# Altium project ice40.PrjPcb
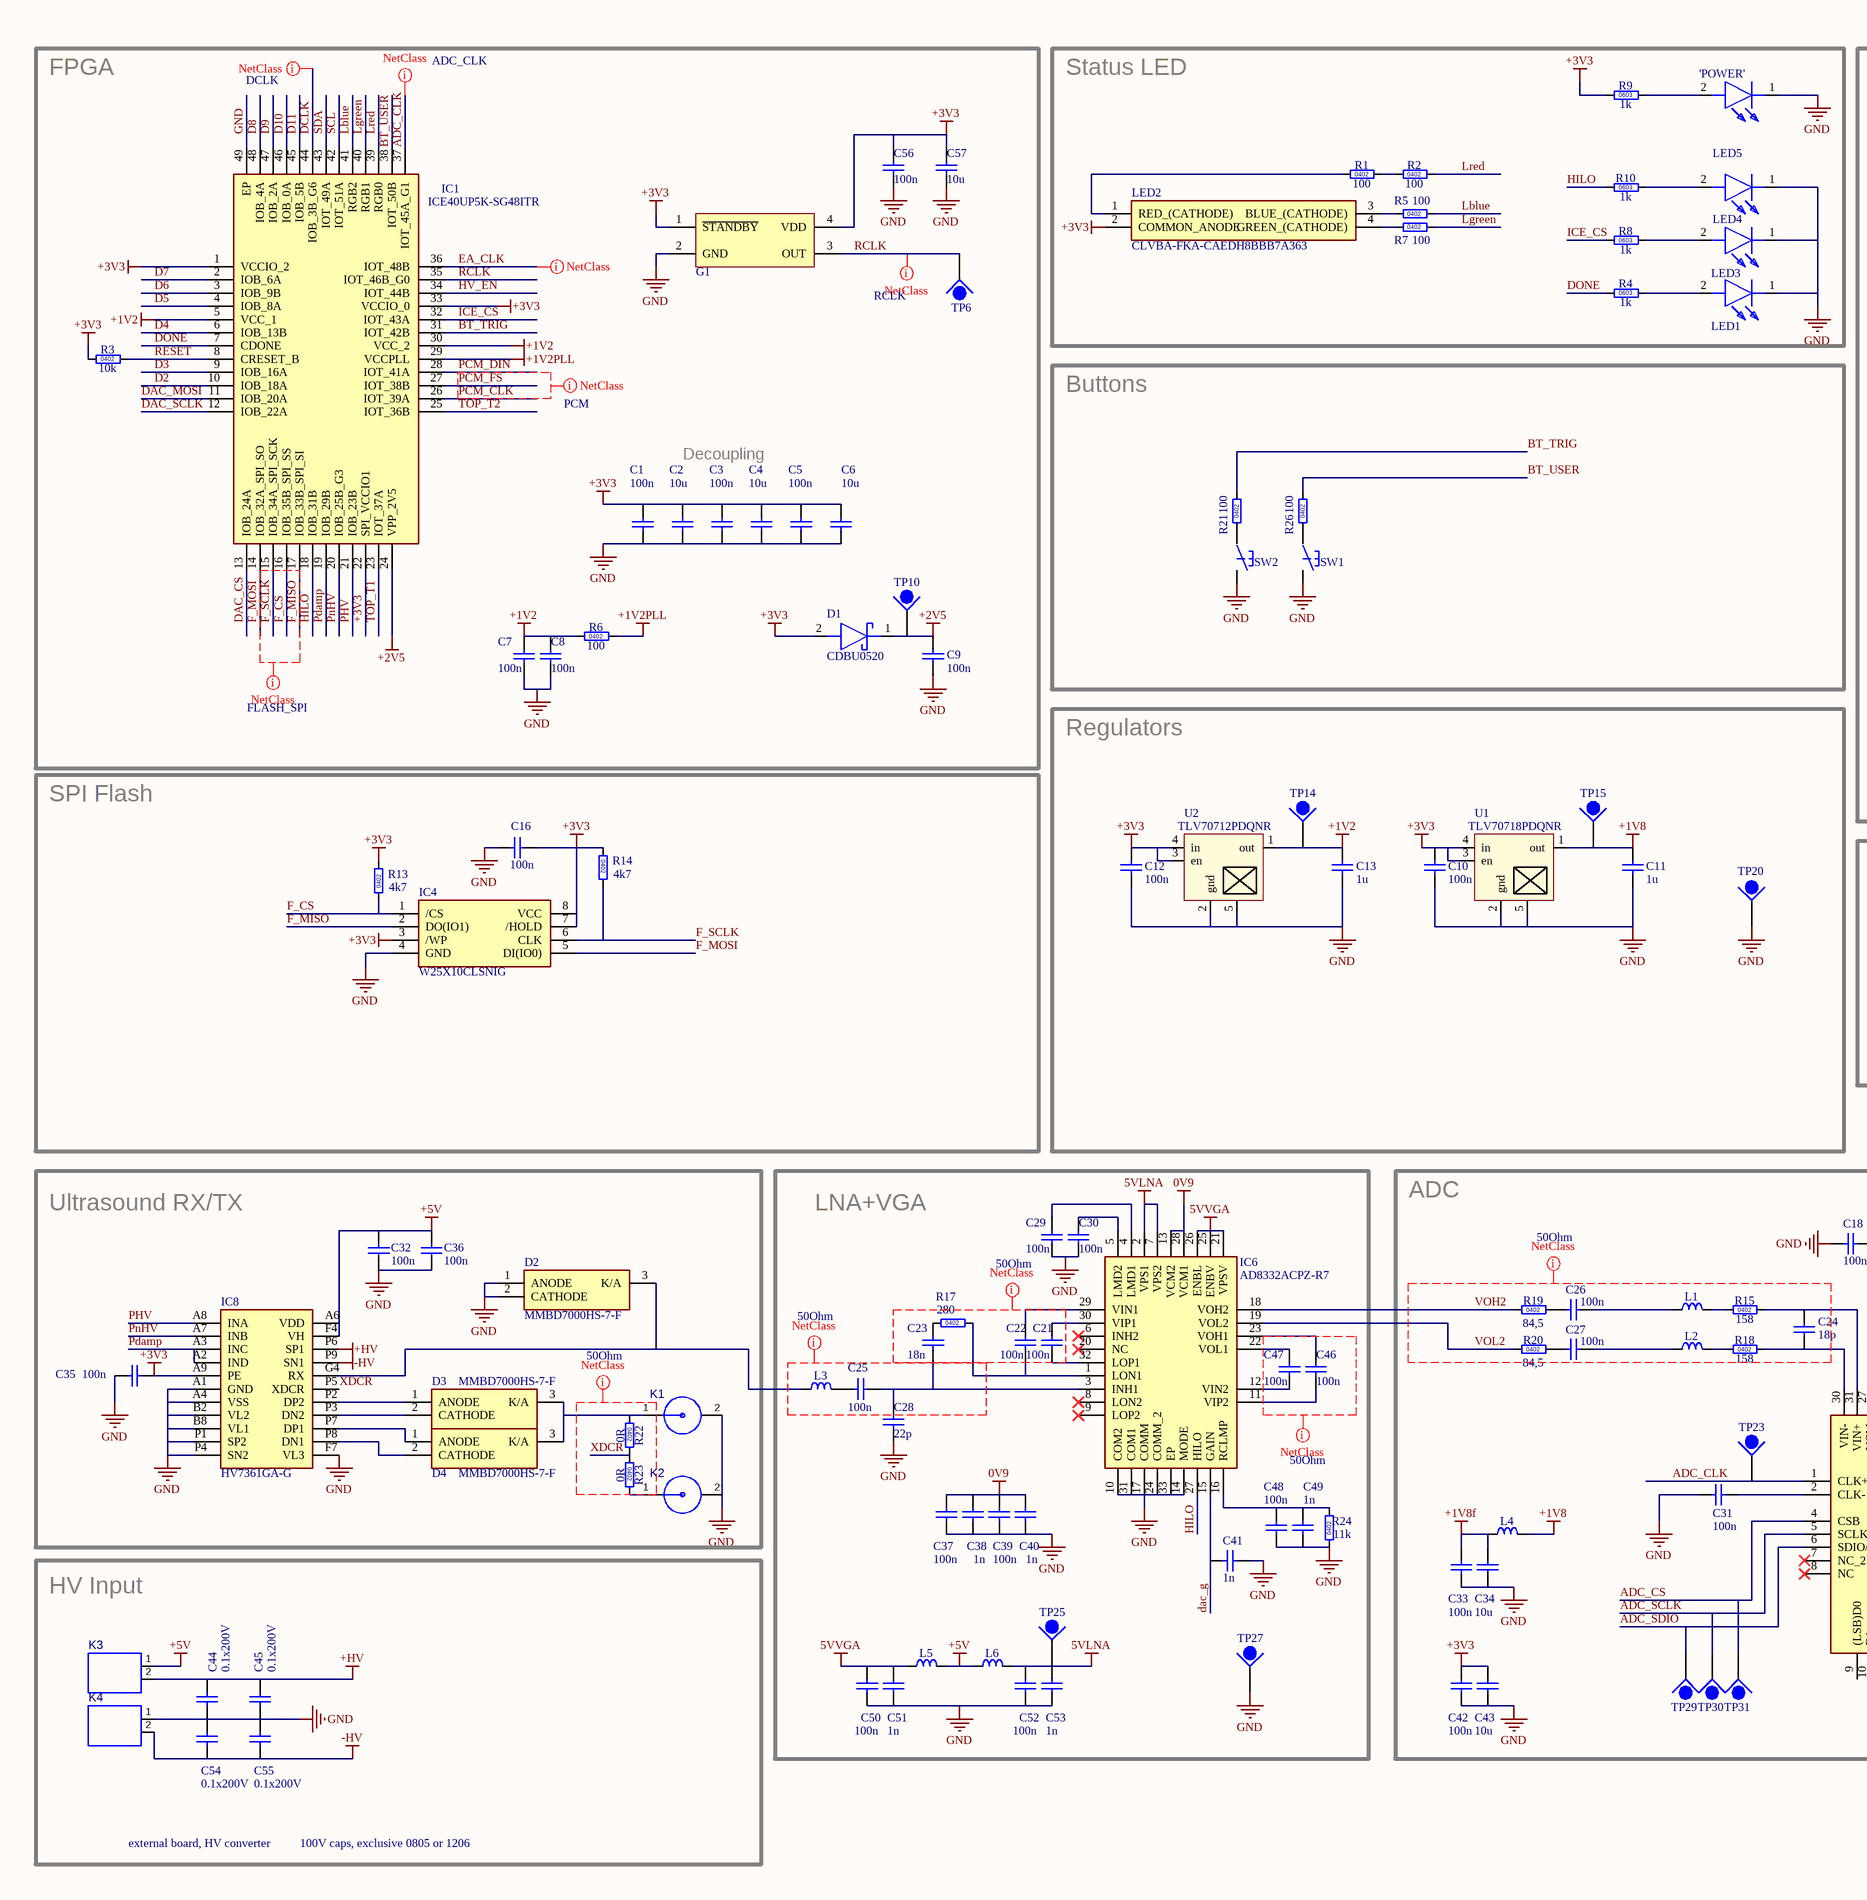
[diagram p0: ice40.SchDoc, left]
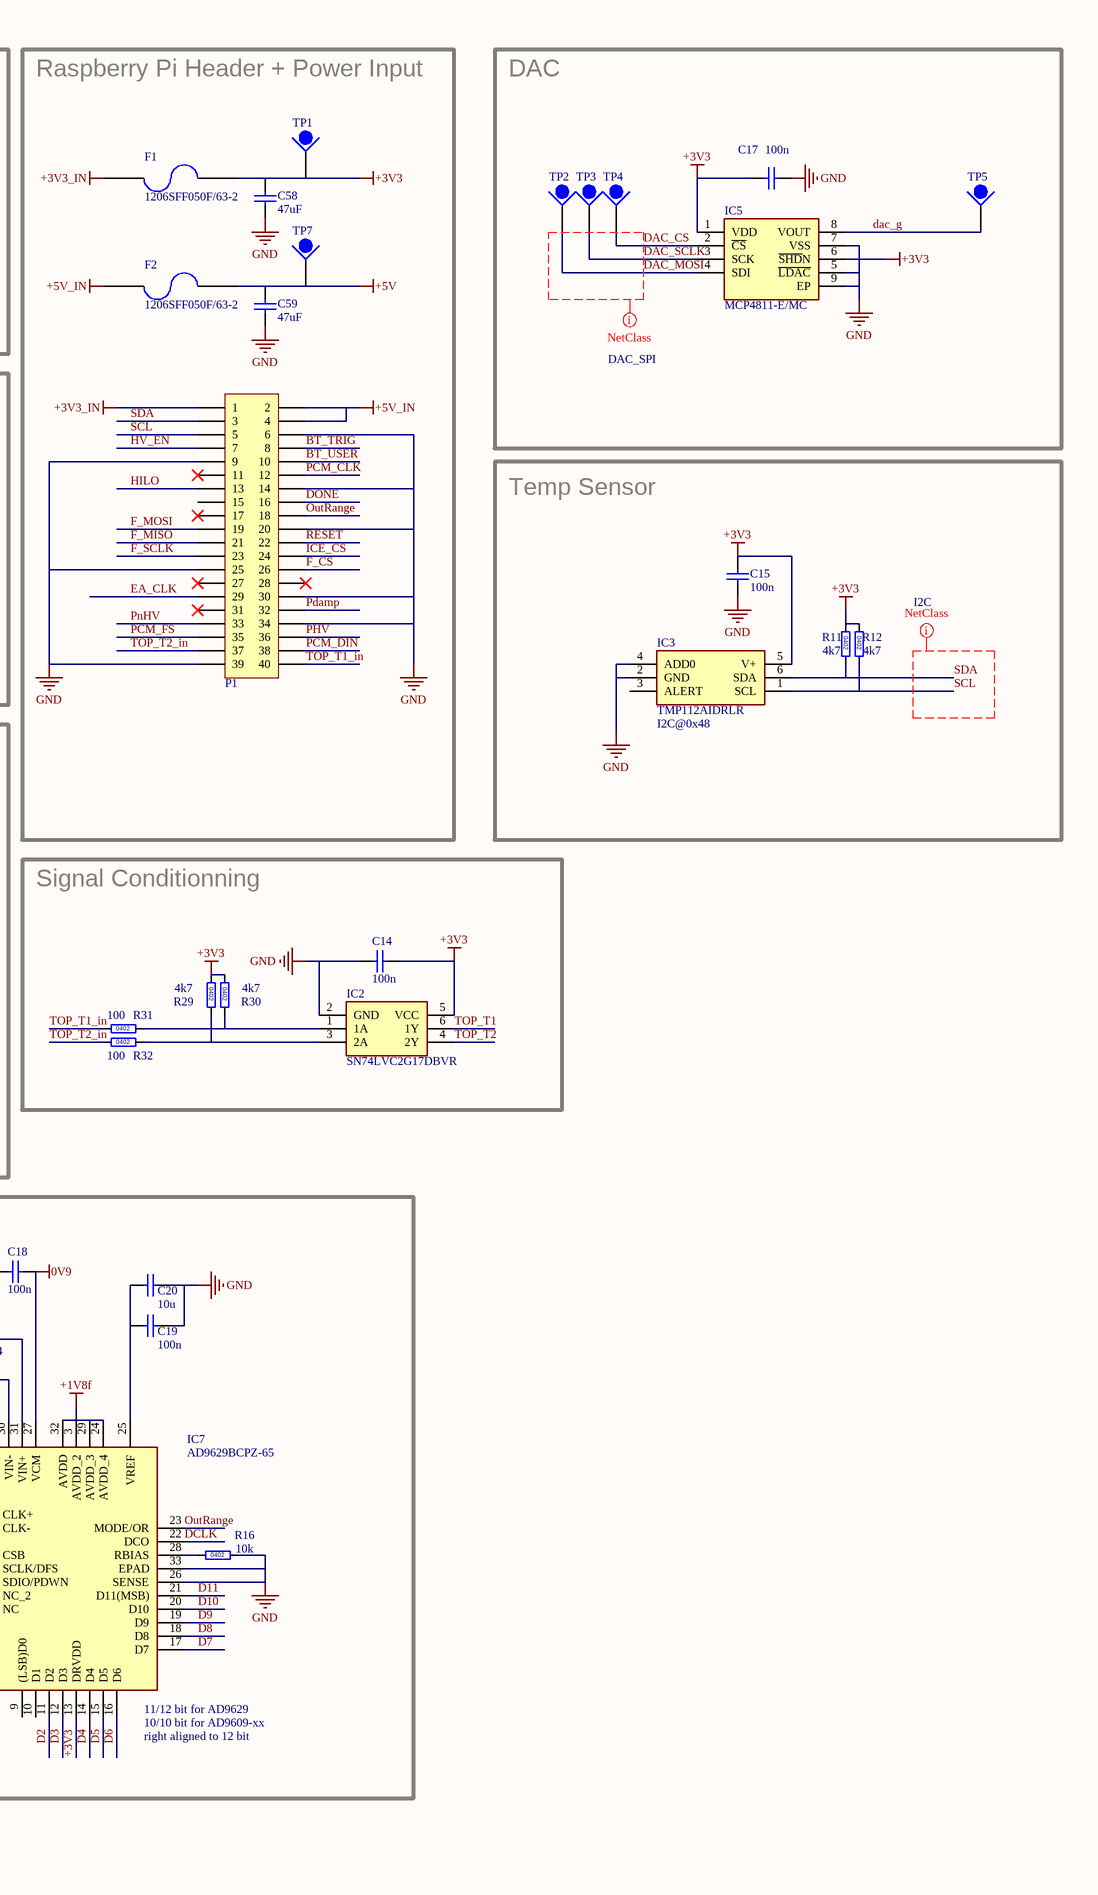
[diagram p1: ice40.SchDoc, right]
1 sheet, 140 parts. Net scope: global (net labels, ports and power ports of the same name join across sheets).
Board file: ice.PcbDoc

## Sheet ice40.SchDoc
size A2; Organization: Altium Limited; Address1: 75 Boul de Mortagne; Address2: Boucherville; Address3: J4B 6Y4; Address4: Canada; ResearchCenter: EME

### Parts
C1  value 100n  [SM0402_3D_cap]  (hidden comment: cap0402)
C2  value 10u  [SM0402_3D_cap]  (hidden comment: cap0402)
C3  value 100n  [SM0402_3D_cap]  (hidden comment: cap0402)
C4  value 10u  [SM0402_3D_cap]  (hidden comment: cap0402)
C5  value 100n  [SM0402_3D_cap]  (hidden comment: cap0402)
C6  value 10u  [SM0402_3D_cap]  (hidden comment: cap0402)
C7  value 100n  [SM0402_3D_cap]  (hidden comment: cap0402)
C8  value 100n  [SM0402_3D_cap]  (hidden comment: cap0402)
C9  value 100n  [SM0402_3D_cap]  (hidden comment: cap0402)
C10  value 100n  [SM0402_3D_cap]  (hidden comment: cap0402)
C11  value 1u  [SM0402_3D_cap]  (hidden comment: cap0402)
C12  value 100n  [SM0402_3D_cap]  (hidden comment: cap0402)
C13  value 1u  [SM0402_3D_cap]  (hidden comment: cap0402)
C14  value 100n  [SM0402_3D_cap]  (hidden comment: cap0402)
C15  value 100n  [SM0402_3D_cap]  (hidden comment: cap0402)
C16  value 100n  [SM0402_3D_cap]  (hidden comment: cap0402)
C17  value 100n  [SM0402_3D_cap]  (hidden comment: cap0402)
C18  value 100n  [SM0402_3D_cap]  (hidden comment: cap0402)
C19  value 100n  [SM0402_3D_cap]  (hidden comment: cap0402)
C20  value 10u  [SM0402_3D_cap]  (hidden comment: cap0402)
C21  value 100n  [SM0402_3D_cap]  (hidden comment: cap0402)
C22  value 100n  [SM0402_3D_cap]  (hidden comment: cap0402)
C23  value 18n  [SM0402_3D_cap]  (hidden comment: cap0402)
C24  value 18p  [SM0402_3D_cap]  (hidden comment: cap0402)
C25  value 100n  [SM0402_3D_cap]  (hidden comment: cap0402)
C26  value 100n  [SM0402_3D_cap]  (hidden comment: cap0402)
C27  value 100n  [SM0402_3D_cap]  (hidden comment: cap0402)
C28  value 22p  [SM0402_3D_cap]  (hidden comment: cap0402)
C29  value 100n  [SM0402_3D_cap]  (hidden comment: cap0402)
C30  value 100n  [SM0402_3D_cap]  (hidden comment: cap0402)
C31  value 100n  [SM0402_3D_cap]  (hidden comment: cap0402)
C32  value 100n  [SM0402_3D_cap]  (hidden comment: cap0402)
C33  value 100n  [SM0402_3D_cap]  (hidden comment: cap0402)
C34  value 10u  [SM0402_3D_cap]  (hidden comment: cap0402)
C35  value 100n  [SM0402_3D_cap]  (hidden comment: cap0402)
C36  value 100n  [SM0402_3D_cap]  (hidden comment: cap0402)
C37  value 100n  [SM0402_3D_cap]  (hidden comment: cap0402)
C38  value 1n  [SM0402_3D_cap]  (hidden comment: cap0402)
C39  value 100n  [SM0402_3D_cap]  (hidden comment: cap0402)
C40  value 1n  [SM0402_3D_cap]  (hidden comment: cap0402)
C41  value 1n  [SM0402_3D_cap]  (hidden comment: cap0402)
C42  value 100n  [SM0402_3D_cap]  (hidden comment: cap0402)
C43  value 10u  [SM0402_3D_cap]  (hidden comment: cap0402)
C44  value 0.1x200V  [SM0805]  (hidden comment: cap0805)
C45  value 0.1x200V  [SM1206]  (hidden comment: cap1206)
C46  value 100n  [SM0402_3D_cap]  (hidden comment: cap0402)
C47  value 100n  [SM0402_3D_cap]  (hidden comment: cap0402)
C48  value 100n  [SM0402_3D_cap]  (hidden comment: cap0402)
C49  value 1n  [SM0402_3D_cap]  (hidden comment: cap0402)
C50  value 100n  [SM0402_3D_cap]  (hidden comment: cap0402)
C51  value 1n  [SM0402_3D_cap]  (hidden comment: cap0402)
C52  value 100n  [SM0402_3D_cap]  (hidden comment: cap0402)
C53  value 1n  [SM0402_3D_cap]  (hidden comment: cap0402)
C54  value 0.1x200V  [SM0805]  (hidden comment: cap0805)
C55  value 0.1x200V  [SM1206]  (hidden comment: cap1206)
C56  value 100n  [SM0402_3D_cap]  (hidden comment: cap0402)
C57  value 10u  [SM0402_3D_cap]  (hidden comment: cap0402)
C58  value 47uF  [CAP_CERAMIC_1206]  (hidden comment: Capacitor)
C59  value 47uF  [CAP_CERAMIC_1206]  (hidden comment: Capacitor)
D1  CDBU0520  [DIOC1709X85N]
D2  MMBD7000HS-7-F  [SOT96P240X110-3N]
D3  MMBD7000HS-7-F  [SOT96P240X110-3N]
D4  MMBD7000HS-7-F  [SOT96P240X110-3N]
F1  1206SFF050F/63-2  [FUSE_1206]
F2  1206SFF050F/63-2  [FUSE_1206]
G1  Oscillator  [OSC_ASEM]  (value not drawn)
IC1  ICE40UP5K-SG48ITR  [QFN50P700X700X100-49N-D]
IC2  SN74LVC2G17DBVR  [SOT95P280X145-6N]
IC3  TMP112AIDRLR  [SOTFL50P160X60-6N]
IC4  W25X10CLSNIG  [SOIC127P600X175-8N]
IC5  MCP4811-E/MC  [SON50P200X300X100-9N]
IC6  AD8332ACPZ-R7  [QFN50P500X500X100-33N]
IC7  AD9629BCPZ-65  [QFN50P500X500X100-33N]
IC8  HV7361GA-G  [BGA22C50P9X14_500X700X105]
K1  SMA_Edge  [AMPHENOL_132357-11]  (value not drawn)
K2  SMA_Edge  [AMPHENOL_132357-11]  (value not drawn)
K3  1x2PLS  [JUMPER2]  (value not drawn)
K4  1x2PLS  [JUMPER2]  (value not drawn)
L1  75R@100MHz  [SM_0805_INDUCTANCE _3D]  (value not drawn)
L2  75R@100MHz  [SM_0805_INDUCTANCE _3D]  (value not drawn)
L3  75R@100MHz  [SM_0805_INDUCTANCE _3D]  (value not drawn)
L4  75R@100MHz  [SM_0805_INDUCTANCE _3D]  (value not drawn)
L5  75R@100MHz  [SM_0805_INDUCTANCE _3D]  (value not drawn)
L6  75R@100MHz  [SM_0805_INDUCTANCE _3D]  (value not drawn)
LED1  HSMW-C191  [LEDC1608X70N]  (value not drawn)
LED2  CLVBA-FKA-CAEDH8BBB7A363  [CLVBAFKACAEDH8BBB7A363]
LED3  HSMW-C191  [LEDC1608X70N]  (value not drawn)
LED4  HSMW-C191  [LEDC1608X70N]  (value not drawn)
LED5  HSMW-C191  [LEDC1608X70N]  (value not drawn)
P1  2x20 2.54mm vertical  [PLD-40]  (value not drawn)
R1  100  [SM0402_3D_res]
R2  100  [SM0402_3D_res]
R3  10k  [SM0402_3D_res]
R4  1k  [SM0603_3D_res]
R5  100  [SM0402_3D_res]
R6  100  [SM0402_3D_res]
R7  100  [SM0402_3D_res]
R8  1k  [SM0603_3D_res]
R9  1k  [SM0603_3D_res]
R10  1k  [SM0603_3D_res]
R11  4k7  [SM0402_3D_res]
R12  4k7  [SM0402_3D_res]
R13  4k7  [SM0402_3D_res]
R14  4k7  [SM0402_3D_res]
R15  158  [SM0402_3D_res]
R16  10k  [SM0402_3D_res]
R17  280  [SM0402_3D_res]
R18  158  [SM0402_3D_res]
R19  84,5  [SM0402_3D_res]
R20  84,5  [SM0402_3D_res]
R21  100  [SM0402_3D_res]
R22  0R  [SM0402_3D_res]
R23  0R  [SM0402_3D_res]
R24  11k  [SM0402_3D_res]
R26  100  [SM0402_3D_res]
R29  4k7  [SM0402_3D_res]
R30  4k7  [SM0402_3D_res]
R31  100  [SM0402_3D_res]
R32  100  [SM0402_3D_res]
SW1  EVQ-P9P02M  [Button 4.7x3.5 _SMT]  (value not drawn)
SW2  EVQ-P9P02M  [Button 4.7x3.5 _SMT]  (value not drawn)
TP1  TP80  [TP80_no_silk]  (value not drawn)  (no BOM)
TP2  TP80  [TP80_no_silk]  (value not drawn)  (no BOM)
TP3  TP80  [TP80_no_silk]  (value not drawn)  (no BOM)
TP4  TP80  [TP80_no_silk]  (value not drawn)  (no BOM)
TP5  TP80  [TP80_no_silk]  (value not drawn)  (no BOM)
TP6  TP80  [TP80_no_silk]  (value not drawn)  (no BOM)
TP7  TP80  [TP80_no_silk]  (value not drawn)  (no BOM)
TP10  TP80  [TP80_no_silk]  (value not drawn)  (no BOM)
TP14  TP80  [TP80_no_silk]  (value not drawn)  (no BOM)
TP15  TP80  [TP80_no_silk]  (value not drawn)  (no BOM)
TP20  TP125X75  [TP125X75]  (value not drawn)  (no BOM)
TP23  TP80  [TP80_no_silk]  (value not drawn)  (no BOM)
TP25  TP80  [TP80_no_silk]  (value not drawn)  (no BOM)
TP27  TP80  [TP80_no_silk]  (value not drawn)  (no BOM)
TP29  TP80  [TP80_no_silk]  (value not drawn)  (no BOM)
TP30  TP80  [TP80_no_silk]  (value not drawn)  (no BOM)
TP31  TP80  [TP80_no_silk]  (value not drawn)  (no BOM)
U1  TLV70718PDQNR  [X2SON - 2]
U2  TLV70712PDQNR  [X2SON - 2]

### Blocks framed on the sheet
FPGA: C1-C9 C56 C57 D1 G1 IC1 R3 R6 TP6 TP10
Status LED: LED1-LED5 R1 R2 R4 R5 R7-R10
Raspberry Pi Header + Power Input: C58 C59 F1 F2 P1 TP1 TP7
DAC: C17 IC5 TP2-TP5
Buttons: R21 R26 SW1 SW2
Temp Sensor: C15 IC3 R11 R12
Regulators: C10-C13 TP14 TP15 TP20 U1 U2
SPI Flash: C16 IC4 R13 R14
Signal Conditionning: C14 IC2 R29-R32
Ultrasound RX/TX: C32 C35 C36 D2-D4 IC8 K1 K2 R22 R23
LNA+VGA: C21-C23 C25 C28-C30 C37-C41 C46-C53 IC6 L3 L5 L6 R17 R24 TP25 TP27
ADC: C18-C20 C24 C26 C27 C31 C33 C34 C42 C43 IC7 L1 L2 L4 R15 R16 R18-R20 TP23 TP29-TP31
HV Input: C44 C45 C54 C55 K3 K4

### Nets
0V9: C18.1 C37.2 C38.2 C39.2 C40.2 IC6.13(VCM2) IC6.28(VCM1) IC7.27(VCM)
5VLNA: C52.2 C53.2 IC6.2(VPS1) IC6.7(VPS2) L6.2 TP25.1
5VVGA: C50.2 C51.2 IC6.21(VPSV) IC6.25(ENBV) IC6.26(ENBL) L5.1
+1V2: C7.2 C8.2 C13.2 IC1.5(VCC_1) IC1.30(VCC_2) R6.1 TP14.1 U2.1(out)
+1V2PLL: IC1.29(VCCPLL) R6.2
+1V8: C11.2 L4.2 TP15.1 U1.1(out)
+1V8f: C33.2 C34.2 IC7.3(AVDD_2) IC7.24(AVDD_4) IC7.29(AVDD_3) IC7.32(AVDD) L4.1
+2V5: C9.2 D1.1(K) IC1.24(VPP_2V5) TP10.1
+3V3: C1.2 C2.2 C3.2 C4.2 C5.2 C6.2 C10.2 C12.2 C14.2 C15.1 C16.1 C17.2 C35.1 C42.2 C43.2 C56.2 C57.2 C58.2 D1.2(A) F1.2 G1.1(~{STANDBY}) G1.4(VDD) IC1.1(VCCIO_2) IC1.22(SPI_VCCIO1) IC1.33(VCCIO_0) IC2.5(VCC) IC3.5(V+) IC4.3(/WP) IC4.7(/HOLD) IC4.8(VCC) IC5.1(VDD) IC5.6(~{SHD}N) IC7.13(DRVDD) IC8.A9(PE) LED2.2(COMMON_ANODE) R3.1 R9.1 R11.1 R12.1 R13.2 R14.1 R29.1 R30.1 TP1.1 U1.3(en) U1.4(in) U2.3(en) U2.4(in)
+3V3_IN: F1.1 P1.1
+5V: C32.1 C36.2 C59.2 F2.2 IC8.A6(VDD) IC8.F4(VH) K3.1 L5.2 L6.1 TP7.1
+5V_IN: F2.1 P1.2 P1.4
+HV: C44.2 C45.2 IC8.P6(SP1) K3.2
-HV: C54.1 C55.1 IC8.P9(SN1) K4.2
GND: C1.1 C2.1 C3.1 C4.1 C5.1 C6.1 C7.1 C8.1 C9.1 C10.1 C11.1 C12.1 C13.1 C14.1 C15.2 C16.2 C17.1 C18.2 C19.1 C20.1 C28.2 C29.2 C30.2 C31.2 C32.2 C33.1 C34.1 C35.2 C36.1 C37.1 C38.1 C39.1 C40.1 C41.1 C42.1 C43.1 C44.1 C45.1 C48.1 C49.1 C50.1 C51.1 C52.1 C53.1 C54.2 C55.2 C56.1 C57.1 C58.1 C59.1 D2.1(ANODE) D2.2(CATHODE) G1.2(GND) IC1.49(EP) IC2.2(GND) IC3.2(GND) IC3.4(ADD0) IC4.4(GND) IC5.5(~{LDAC}) IC5.7(VSS) IC5.9(EP) IC6.10(COM2) IC6.14(MODE) IC6.17(COMM) IC6.24(COMM_2) IC6.31(COM1) IC6.33(EP) IC7.26(SENSE) IC7.33(EPAD) IC8.A1(GND) IC8.A4(VSS) IC8.B2(VL2) IC8.B8(VL1) IC8.F7(VL3) IC8.P1(SP2) IC8.P4(SN2) K1.2 K2.2 K4.1 LED1.1(K) LED3.1(K) LED4.1(K) LED5.1(K) P1.6 P1.9 P1.14 P1.20 P1.25 P1.30 P1.34 P1.39 R16.2 R24.1 SW1.3 SW1.4 SW2.3 SW2.4 TP20.1 TP27.1 U1.2(gnd) U1.5(tp) U2.2(gnd) U2.5(tp)
ADC_CLK: IC1.37(IOT_45A_G1) IC7.1(CLK+) TP23.1
ADC_CS: IC7.4(CSB) TP31.1
ADC_SCLK: IC7.5(SCLK/DFS) TP30.1
ADC_SDIO: IC7.6(SDIO/PDWN) TP29.1
BT_TRIG: IC1.31(IOT_42B) P1.8 R21.2
BT_USER: IC1.38(IOT_50B) P1.10 R26.2
D2: IC1.10(IOB_18A) IC7.11(D2)
D3: IC1.9(IOB_16A) IC7.12(D3)
D4: IC1.6(IOB_13B) IC7.14(D4)
D5: IC1.4(IOB_8A) IC7.15(D5)
D6: IC1.3(IOB_9B) IC7.16(D6)
D7: IC1.2(IOB_6A) IC7.17(D7)
D8: IC1.48(IOB_4A) IC7.18(D8)
D9: IC1.47(IOB_2A) IC7.19(D9)
D10: IC1.46(IOB_0A) IC7.20(D10)
D11: IC1.45(IOB_5B) IC7.21(D11(MSB))
DAC_CS: IC1.13(IOB_24A) IC5.2(~{CS}) TP4.1
dac_g: C41.2 IC5.8(VOUT) IC6.15(GAIN) TP5.1
DAC_MOSI: IC1.11(IOB_20A) IC5.4(SDI) TP2.1
DAC_SCLK: IC1.12(IOB_22A) IC5.3(SCK) TP3.1
DCLK: IC1.44(IOB_3B_G6) IC7.22(DCO)
DONE: IC1.7(CDONE) P1.16 R4.1
EA_CLK: IC1.36(IOT_48B) P1.29
F_CS: IC1.16(IOB_35B_SPI_SS) IC4.1(/CS) P1.26 R13.1
F_MISO: IC1.17(IOB_33B_SPI_SI) IC4.2(DO(IO1)) P1.21
F_MOSI: IC1.14(IOB_32A_SPI_SO) IC4.5(DI(IO0)) P1.19
F_SCLK: IC1.15(IOB_34A_SPI_SCK) IC4.6(CLK) P1.23 R14.2
HILO: IC1.18(IOB_31B) IC6.27(HILO) P1.13 R10.1
HV_EN: IC1.34(IOT_44B) P1.7
ICE_CS: IC1.32(IOT_43A) P1.24 R8.1
Lblue: IC1.41(RGB2) R5.2
Lgreen: IC1.40(RGB1) R7.2
Lred: IC1.39(RGB0) R2.2
OutRange: IC7.23(MODE/OR) P1.18
PCM_CLK: IC1.26(IOT_39A) P1.12
PCM_DIN: IC1.28(IOT_41A) P1.38
PCM_FS: IC1.27(IOT_38B) P1.35
Pdamp: IC1.19(IOB_29B) IC8.A2(IND) IC8.A3(INC) P1.32
PHV: IC1.21(IOB_23B) IC8.A8(INA) P1.36
PnHV: IC1.20(IOB_25B_G3) IC8.A7(INB) P1.33
RCLK: G1.3(OUT) IC1.35(IOT_46B_G0) TP6.1
RESET: IC1.8(CRESET_B) P1.22 R3.2
SCL: IC1.42(IOT_51A) IC3.1(SCL) P1.5 R12.2
SDA: IC1.43(IOT_49A) IC3.6(SDA) P1.3 R11.2
TOP_T1: IC1.23(IOT_37A) IC2.6(1Y)
TOP_T1_in: P1.40 R31.1
TOP_T2: IC1.25(IOT_36B) IC2.4(2Y)
TOP_T2_in: P1.37 R32.1
VOH2: IC6.18(VOH2) R19.1
VOL2: IC6.19(VOL2) R20.1
XDCR: IC8.P5(XDCR) R22.2 R23.1
NetC19_2: C19.2 C20.2 IC7.25(VREF)
NetC21_1: C21.1 IC6.30(VIP1)
NetC21_2: C21.2 IC6.32(LOP1)
NetC22_1: C22.1 IC6.1(LON1) R17.2
NetC22_2: C22.2 IC6.29(VIN1)
NetC23_1: C23.1 C25.1 C28.1 IC6.3(INH1)
NetC23_2: C23.2 R17.1
NetC24_1: C24.1 IC7.30(VIN-) R18.2
NetC24_2: C24.2 IC7.31(VIN+) R15.2
NetC25_2: C25.2 L3.2
NetC26_1: C26.1 L1.1
NetC26_2: C26.2 R19.2
NetC27_1: C27.1 L2.1
NetC27_2: C27.2 R20.2
NetC29_1: C29.1 IC6.4(LMD1)
NetC30_1: C30.1 IC6.5(LMD2)
NetC31_1: C31.1 IC7.2(CLK-)
NetC46_1: C46.1 IC6.11(VIP2)
NetC46_2: C46.2 IC6.23(VOH1)
NetC47_1: C47.1 IC6.12(VIN2)
NetC47_2: C47.2 IC6.22(VOL1)
NetC48_2: C48.2 C49.2 IC6.16(RCLMP) R24.2
NetD2_3: D2.3(K/A) IC8.G4(RX) L3.1
NetD3_1: D3.1(ANODE) IC8.P2(DP2)
NetD3_2: D3.2(CATHODE) IC8.P3(DN2)
NetD3_3: D3.3(K/A) D4.3(K/A) K1.1 R22.1
NetD4_1: D4.1(ANODE) IC8.P7(DP1)
NetD4_2: D4.2(CATHODE) IC8.P8(DN1)
NetIC2_1: IC2.1(1A) R30.2 R31.2
NetIC2_3: IC2.3(2A) R29.2 R32.2
NetIC7_28: IC7.28(RBIAS) R16.1
NetK2_1: K2.1 R23.2
NetL1_2: L1.2 R15.1
NetL2_2: L2.2 R18.1
NetLED1_2: LED1.2(A) R4.2
NetLED2_1: LED2.1(RED_(CATHODE)) R1.1
NetLED2_3: LED2.3(BLUE_(CATHODE)) R5.1
NetLED2_4: LED2.4(GREEN_(CATHODE)) R7.1
NetLED3_2: LED3.2(A) R8.2
NetLED4_2: LED4.2(A) R10.2
NetLED5_2: LED5.2(A) R9.2
NetR1_2: R1.2 R2.1
NetR21_1: R21.1 SW2.1 SW2.2
NetR26_1: R26.1 SW1.1 SW1.2

Not connected (* = marked no-connect by the designer): IC3 3(ALERT); IC6 6(INH2)* 8(LON2)* 9(LOP2)* 20(NC)*; IC7 7(NC_2)* 8(NC)* 9((LSB)D0) 10(D1); P1 11* 15 17* 27* 28* 31*

### Layout directives
net class RCLK: RCLK
net class 50Ohm: (no net found under the mark), VOH2, VOL2, XDCR
net class DCLK: DCLK
net class ADC_CLK: ADC_CLK
net class EA_CLK: EA_CLK
net class FLASH_SPI: F_CS, F_MISO, F_MOSI, F_SCLK
net class PCM: PCM_CLK, PCM_DIN, PCM_FS
net class I2C: SCL, SDA
net class DAC_SPI: DAC_CS, DAC_MOSI, DAC_SCLK

### Notes on the sheet
- (near LED5) 'POWER'
- Decoupling
- (near IC3) I2C@0x48
- (near IC7) 11/12 bit for AD9629
- (near IC7) 10/10 bit for AD9609-xx
- (near IC7) right aligned to 12 bit
- external board, HV converter
- 100V caps, exclusive 0805 or 1206
- Revision
- Title:
- Project Name:
- Date:
- Project #:
- Research Center
- Drawn By:
- Sheet
- of
- 75 Boul de Mortagne
- Boucherville
- J4B 6Y4
- Canada
- (in symbol Res_0402_EU) 0402
- (in symbol Res_0603_EU) 0603

### Library data of the parts
C1-C43 C46-C53 C56 C57 = cap0402: Capacitor  0402 inch; Published: 8-Jun-2000; LatestRevisionDate: 17-Jul-2002; LatestRevisionNote: Re-released for DXP Platform.; PackageReference: RAD-0.3; Publisher: Altium Limited; PackageDescription: Radial Cap, Thru-Hole; 2 Leads; 0.3 in Pin Spacing
C44 C54 = cap0805: Capacitor; Published: 8-Jun-2000; LatestRevisionDate: 17-Jul-2002; LatestRevisionNote: Re-released for DXP Platform.; PackageReference: RAD-0.3; Publisher: Altium Limited; PackageDescription: Radial Cap, Thru-Hole; 2 Leads; 0.3 in Pin Spacing
C45 C55 = cap1206: Capacitor; Published: 8-Jun-2000; LatestRevisionDate: 17-Jul-2002; LatestRevisionNote: Re-released for DXP Platform.; PackageReference: RAD-0.3; Publisher: Altium Limited; PackageDescription: Radial Cap, Thru-Hole; 2 Leads; 0.3 in Pin Spacing
C58 C59 = C_47uF_1206_SMD_JB_20%_25V_TDK_C: CAP CER 47UF 25V X5R 1206; ManufacturerPartNumber: C3216JB1E476M160AC; Validation Status: Verified; ATT Capacitor Type: Ceramic; ATT Case: 1206 (3216 Metric); ATT Temperature Coefficient: JB; ATT Tolerance: ±20%; DigikeyPartNumber: 445-11717-1-ND; HelpURL: https://product.tdk.com/info/en/documents/chara_sheet/C3216JB1E476M160AC.pdf?ref_disty=digikey; PhotoURI: https://media.digikey.com/Renders/Murata%20Renders/1206-(3216-Metric)-1,80mm.jpg; RoHS: Compliant; Technology: SMT; ATT Lifetime @ Temp: -; ATT Working Voltage: 25V; ATT Operating Temperature: -25°C ~ 85°C
D1 = CDBU0520: Schottky Diode; Manufacturer_Name: Comchip Technology; Datasheet Link: http://www.comchiptech.com/admin/files/product/CDBU0520-HF-RevA797161.pdf; Height: 0.85mm; Manufacturer_Part_Number: CDBU0520; Mouser Part Number: 750-CDBU0520; Mouser Price/Stock: https://www.mouser.co.uk/ProductDetail/Comchip-Technology/CDBU0520/?qs=QrYNfmA0esYvGSGDalbccA%3D%3D; Arrow Part Number: CDBU0520; Arrow Price/Stock: https://www.arrow.com/en/products/cdbu0520/comchip-technology
D2-D4 = MMBD7000HS-7-F: Diode; Manufacturer_Name: Diodes Inc.; Datasheet Link: https://www.diodes.com/assets/Datasheets/ds31782.pdf; Height: 1.1mm; Manufacturer_Part_Number: MMBD7000HS-7-F; Mouser Part Number: 621-MMBD7000HS-7-F; Mouser Price/Stock: https://www.mouser.co.uk/ProductDetail/Diodes-Incorporated/MMBD7000HS-7-F/?qs=4YT44p7w2bs7ic313M4gfA%3D%3D; Arrow Part Number: MMBD7000HS-7-F; Arrow Price/Stock: https://www.arrow.com/en/products/mmbd7000hs-7-f/diodes-incorporated
F1 F2 = 1206SFF050F/63-2: 500mA AC 63V DC Fuse Board Mount Surface Mount 1206; ATT Technology: SMD; ATT Fuse size: 1206; DigikeyPartNumber: 1206SFF050F/63-2CT-ND; ManufacturerPartNumber: 1206SFF050F/63-2; helpURL: https://www.littelfuse.com/~/media/electronics/datasheets/fuses/littelfuse_fuse_sfs_datasheet.pdf.pdf; photoURL: https://media.digikey.com/photos/Tyco%20Raychem%20Photos/1206SFF%20SERIES.jpg; ATT Current Rating (Amps): 500mA; ATT Voltage Rating DC: 63V; ATT Operating Temperature: -55°C ~ 125°C
G1 = ASEMB-80.000MHZ-LY-T: OSC MEMS 80 MHZ SMD; Validation Status: Verified; ATT Frequency: 80Mhz; ATT Frequency Stability: ±10ppm; ATT Package / Case: 4-SMD, No Lead (DFN, LCC); ATT Series: ASEMB, Pure Silicon™; ATT Supply Current: 16mA; ATT Supply Voltage: 1.7 V ~ 3.6 V; ATT Type: MEMS (Silicon); HelpURL: https://www.mouser.ca/datasheet/2/3/ASEMB-7474.pdf; PhotoURI: http://media.digikey.com/Photos/Abracon%20Corporation%20Photos/ASEMB3.2-SERIES.jpg; RoHS: Compliant; Technology: SMT; ATT Operating Temperature: -40°C ~ 85°C; Supplier 1: Digi-Key; Supplier Part Number 1: 535-11082-1-ND
IC1 = ICE40UP5K-SG48ITR: Integrated Circuit; Manufacturer_Name: Lattice Semiconductor; Datasheet Link: https://www.arrow.com/en/products/ice40up5k-sg48itr/lattice-semiconductor; Height: 1mm; Manufacturer_Part_Number: ICE40UP5K-SG48ITR; Mouser Part Number: 842-40UP5KSG48ITR; Mouser Price/Stock: https://www.mouser.com/Search/Refine.aspx?Keyword=842-40UP5KSG48ITR; Arrow Part Number: ICE40UP5K-SG48ITR; Arrow Price/Stock: https://www.arrow.com/en/products/ice40up5k-sg48itr/lattice-semiconductor
IC2 = SN74LVC2G17DBVR: Integrated Circuit; Manufacturer_Name: Texas Instruments; Datasheet Link: http://www.ti.com/lit/gpn/sn74lvc2g17; Height: 1.45mm; Manufacturer_Part_Number: SN74LVC2G17DBVR; Mouser Part Number: 595-SN74LVC2G17DBVR; Mouser Price/Stock: https://www.mouser.co.uk/ProductDetail/Texas-Instruments/SN74LVC2G17DBVR/?qs=X1HXWTtiZ0RnstCufGEJxQ%3D%3D; Arrow Part Number: SN74LVC2G17DBVR; Arrow Price/Stock: https://www.arrow.com/en/products/sn74lvc2g17dbvr/texas-instruments
IC3 = TMP112AIDRLR: Integrated Circuit; Manufacturer_Name: Texas Instruments; Datasheet Link: http://www.ti.com/general/docs/suppproductinfo.tsp?distId=10&gotoUrl=http%3A%2F%2Fwww.ti.com%2Flit%2Fgpn%2Ftmp112; Height: 0.6mm; Manufacturer_Part_Number: TMP112AIDRLR; Mouser Part Number: 595-TMP112AIDRLR; Mouser Price/Stock: https://www.mouser.co.uk/ProductDetail/Texas-Instruments/TMP112AIDRLR/?qs=62Z1lCHpKYghtK4%2FJn2ysA%3D%3D; Arrow Part Number: TMP112AIDRLR; Arrow Price/Stock: https://www.arrow.com/en/products/tmp112aidrlr/texas-instruments
IC4 = W25X10CLSNIG: Integrated Circuit; Manufacturer_Name: Winbond; Datasheet Link: https://www.arrow.com/en/products/w25x10clsnig/winbond-electronics; Height: 1.75mm; Manufacturer_Part_Number: W25X10CLSNIG; Mouser Part Number: 454-W25X10CLSNIG; Mouser Price/Stock: https://www.mouser.co.uk/ProductDetail/Winbond/W25X10CLSNIG?qs=qSfuJ%252Bfl%2Fd58%252Bc3wxS8Vmg%3D%3D; Arrow Part Number: W25X10CLSNIG; Arrow Price/Stock: https://www.arrow.com/en/products/w25x10clsnig/winbond-electronics
IC5 = MCP4811-E/MC: DAC 1-CH Resistor-String 10-bit Automotive 8-Pin DFN EP Tube; Manufacturer: Microchip; Resolution: 10b; Integral Nonlinearity (INL): 3.5LSB; Output Type: Voltage; Interface: SPI,Serial,3-WIRE; Number of DAC Channels: 1; Nominal Supply Current: 330uA; Max Supply Voltage: 5.5V; Min Supply Voltage: 2.7V; Operating Supply Voltage: 5V; Settling Time: 4.5us; Number of Bits: 10; Polarity: Bipolar; Input Offset Voltage (Vos): 820uV; Supplier 1: Digi-Key; Supplier Part Number 1: MCP4811-E/MC-ND; ManufacturerPartNumber: MCP4811-E/MC; RoHS: Yes; Mount: Surface Mount; Case/Package: DFN; Number of Pins: 8; Min Operating Temperature: -40°C; Max Operating Temperature: 125°C; Packaging: Rail/Tube; Package Quantity: 150; Number of Channels: 1; Number of Converters: 1; Output Polarity: Bipolar; Supply Current: 330uA; Full Scale Error: 3.5LSB; Length: 2mm; Width: 3mm; Height: 0.95mm; Radiation Hardening: No; REACH SVHC: No SVHC; Lead Free: Lead Free; ComponentLink1URL: https://datasheet.ciiva.com/26922/getdatasheetpartid-765518-26922591.pdf?src-supplier=Verical; ComponentLink1Description: datasheet
IC6 = AD8332ACPZ-R7: Integrated Circuit; Manufacturer_Name: Analog Devices; Manufacturer_Part_Number: AD8332ACPZ-R7; Mouser Part Number: 584-AD8332ACPZ-R7; Mouser Price/Stock: https://www.mouser.co.uk/ProductDetail/Analog-Devices/AD8332ACPZ-R7?qs=%2FtpEQrCGXCzEVqYW%252BWJwOA%3D%3D; Arrow Part Number: AD8332ACPZ-R7; Arrow Price/Stock: https://www.arrow.com/en/products/ad8332acpz-r7/analog-devices
IC7 = AD9629BCPZ-65: Integrated Circuit; Manufacturer_Name: Analog Devices; Manufacturer_Part_Number: AD9629BCPZ-65; Mouser Part Number: 584-AD9629BCPZ-65; Mouser Price/Stock: https://www.mouser.co.uk/ProductDetail/Analog-Devices/AD9629BCPZ-65?qs=BpaRKvA4VqGjvk9AFyB3jg%3D%3D; Arrow Part Number: AD9629BCPZ-65; Arrow Price/Stock: https://www.arrow.com/en/products/ad9629bcpz-65/analog-devices
IC8 = HV7361GA-G: Integrated Circuit; Manufacturer_Name: Microchip; Datasheet Link: http://ww1.microchip.com/downloads/en/DeviceDoc/20005570C.pdf; Height: 1.05mm; Manufacturer_Part_Number: HV7361GA-G; Mouser Part Number: 579-HV7361GA-G; Mouser Price/Stock: https://www.mouser.co.uk/ProductDetail/Microchip-Technology/HV7361GA-G?qs=NoqMqJKvPFJ98Yl1cb744A%3D%3D; Arrow Part Number: HV7361GA-G; Arrow Price/Stock: https://www.arrow.com/en/products/hv7361ga-g/microchip-technology
L1 L2 = Ind_Chip_0805: chip inductance; Part Number: IND0805_MURATA_BLM21BB750SN1D; Part Description: SMD EMIFIL Suppression Chip Ferrite Bead; Manufacturer: MURATA; Manufacturer Part Number: AIML-0805HC-1R5M-T; Power: 700mA; Resistance: 0.16R; Tolerance: ±25%; Table: Inductors SMD; Component Kind: Standard; Component Type: Standard; Footprint: INDC2012X105N; Pin Count: 2; Value: 75R@100MHz; Status: None; Case: 0805; Mounted: Yes; Socket: No; SMD: Yes; ComponentHeight: 1.05mm; Author: S. Jafar; CreateDate: 12/21/2015; LatestRevisionDate: 12/21/2015; Supplier 1: Digi-Key; Supplier Part Number 1: 535-12788-1-ND
L3-L6 = Ind_Chip_0805: Ferrite Beads Multi-Layer 600Ohm 25% 100MHz 1A 0.2Ohm DCR 0603 T/R; Part Number: IND0805_MURATA_BLM21BB750SN1D; Part Description: SMD EMIFIL Suppression Chip Ferrite Bead; Manufacturer: MURATA; Manufacturer Part Number: BLM21BB750SN1D; ManufacturerPartNumber: PBY160808T-601Y-N; Power: 700mA; Resistance: 0.16R; Table: Inductors SMD; Component Kind: Standard; Component Type: Standard; Footprint: INDC2012X105N; Pin Count: 2; Value: 75R@100MHz; Status: None; Tolerance: ±25%; Case: 0805; Mounted: Yes; Socket: No; SMD: Yes; ComponentHeight: 1.05mm; Author: S. Jafar; CreateDate: 12/21/2015; LatestRevisionDate: 12/21/2015; Supplier 1: Digi-Key; Supplier Part Number 1: 13-PBY160808T-601Y-NCT-ND; RoHS: Yes; Case/Package: 0603; RoHS Compliant: Yes; ComponentLink1URL: http://components.arrow.com/part/dataview/0323_06472368?src-supplier=Arrow+Europe; ComponentLink1Description: http://components.arrow.com/part/dataview/0323_06472368?src-supplier=Arrow+Europe
LED1 LED3-LED5 = HSMW-C191: LED; Manufacturer_Name: Avago Technologies; Datasheet Link: https://docs.broadcom.com/docs/AV02-0186EN; Height: 0.7mm; Manufacturer_Part_Number: HSMW-C191; Mouser Part Number: 630-HSMW-C191; Mouser Price/Stock: https://www.mouser.com/Search/Refine.aspx?Keyword=630-HSMW-C191
LED2 = CLVBA-FKA-CAEDH8BBB7A363: LED; Manufacturer_Name: Cree; Datasheet Link: http://www.cree.com/led-components/media/documents/ds-CLVBA-FKA.pdf; Height: 2.1mm; Manufacturer_Part_Number: CLVBA-FKA-CAEDH8BBB7A363; Mouser Part Number: 941-VBAFKACAEDH8B7A3; Mouser Price/Stock: https://www.mouser.co.uk/ProductDetail/Cree-Inc/CLVBA-FKA-CAEDH8BBB7a363/?qs=3AcK5DacLboXYkg4biCgSA%3D%3D; Arrow Part Number: CLVBA-FKA-CAEDH8BBB7A363; Arrow Price/Stock: https://www.arrow.com/en/products/clvba-fka-caedh8bbb7a363/cree
P1 = 2x20 2.54mm vertical: Header, 40-Pin; LatestRevisionDate: 17-Jul-2002; LatestRevisionNote: Re-released for DXP Platform.; Publisher: Altium Limited
R1-R3 R5-R7 R15-R24 R26 R31 R32 = Res_0402_EU: Part Number: R1206_4K7_1%_0.25W_100PPM; Part Description: General Purpose Thick Film Chip Resistor; Manufacturer: GENERIC; Manufacturer1 Part Number: NRC12F4701TRF; Value: 4k7; Power: 0.25W; TC: ±100ppm/°C; Tolerance: ±1%; Table: Resistors SMD; Component Kind: Standard; Component Type: Standard; Footprint: RESC3216X65N; Pin Count: 2; Status: Preferred; Manufacturer Part Number: R1206_4K7_1%_0.25W_100PPM; Case: 1206; Mounted: Yes; Socket: No; SMD: Yes; Manufacturer1 Example: NIC COMPONENT; Manufacturer1 ComponentHeight: 0.65mm; HelpURL: \\cern.ch\dfs\Applications\Altium\Datasheets\R1206_NIC_NRC.pdf; Author: CERN DEM JLC; CreateDate: 12/3/2007; LatestRevisionDate: 3/13/2008
R4 R8-R10 = Res_0603_EU: Part Number: R1206_4K7_1%_0.25W_100PPM; Part Description: General Purpose Thick Film Chip Resistor; Manufacturer: GENERIC; Manufacturer1 Part Number: NRC12F4701TRF; Value: 4k7; Power: 0.25W; TC: ±100ppm/°C; Tolerance: ±1%; Table: Resistors SMD; Component Kind: Standard; Component Type: Standard; Footprint: RESC3216X65N; Pin Count: 2; Status: Preferred; Manufacturer Part Number: R1206_4K7_1%_0.25W_100PPM; Case: 1206; Mounted: Yes; Socket: No; SMD: Yes; Manufacturer1 Example: NIC COMPONENT; Manufacturer1 ComponentHeight: 0.65mm; HelpURL: \\cern.ch\dfs\Applications\Altium\Datasheets\R1206_NIC_NRC.pdf; Author: CERN DEM JLC; CreateDate: 12/3/2007; LatestRevisionDate: 3/13/2008
R11-R14 R29 R30 = Res_0402_EU: Part Number: R1206_4K7_1%_0.25W_100PPM; Part Description: General Purpose Thick Film Chip Resistor; Manufacturer: GENERIC; Manufacturer1 Part Number: NRC12F4701TRF; Power: 0.25W; TC: ±100ppm/°C; Tolerance: ±1%; Table: Resistors SMD; Component Kind: Standard; Component Type: Standard; Footprint: RESC3216X65N; Pin Count: 2; Value: 4k7; Status: Preferred; Manufacturer Part Number: R1206_4K7_1%_0.25W_100PPM; Case: 1206; Mounted: Yes; Socket: No; SMD: Yes; Manufacturer1 Example: NIC COMPONENT; Manufacturer1 ComponentHeight: 0.65mm; HelpURL: \\cern.ch\dfs\Applications\Altium\Datasheets\R1206_NIC_NRC.pdf; Author: CERN DEM JLC; CreateDate: 12/3/2007; LatestRevisionDate: 3/13/2008
SW1 SW2 = Button 4.7x3.5 SMT
U1 = TLV70718PDQNR: low drop LDO
U2 = TLV70712PDQNR: low drop LDO
K1 K2 = SMA_Edge: Value: *
K3 K4 = 1x2PLS: Value: *

## Assembly variants
HighVoltageCap_0805: not fitted C45 C55 K1 K2 K3 K4 P1
HighVoltageCap_1206: not fitted C44 C54 K1 K2 K3 K4 P1